# EAGLE design r8.3_1284 (EAGLE 7.4.0)
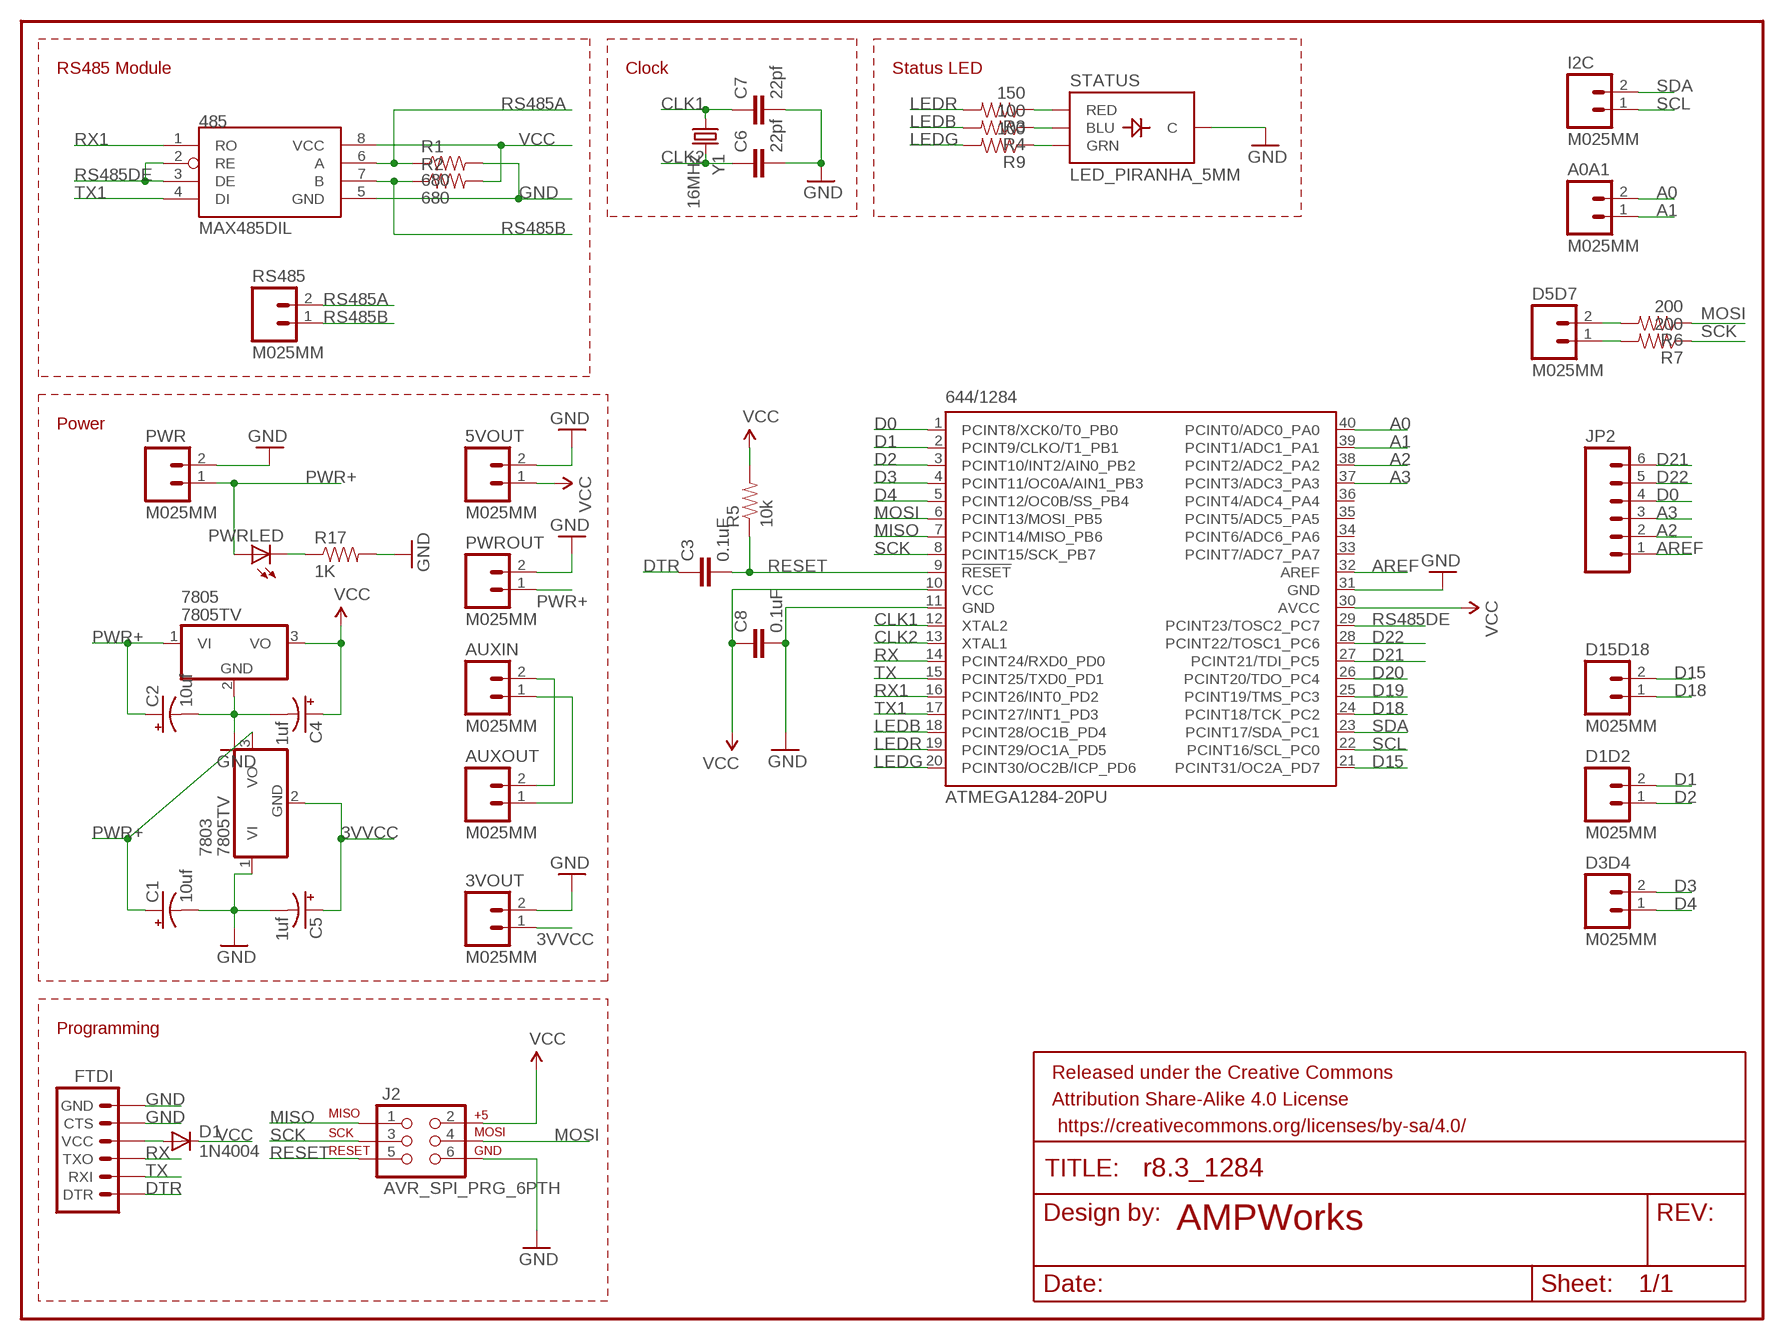
[diagram p0: schematic, sheet 1]

## Parts
3VOUT  M025MM  [SCREWTERMINAL-5MM-2]
5VOUT  M025MM  [SCREWTERMINAL-5MM-2]
485  MAX485DIL  [DIL08]
644/1284  ATMEGA1284-20PU  ATMEGA644-20PU  [DIL40]
7803  7805TV  [TO220V]
7805  7805TV  [TO220V]
A0A1  M025MM  [SCREWTERMINAL-5MM-2]
AUXIN  M025MM  [SCREWTERMINAL-5MM-2]
AUXOUT  M025MM  [SCREWTERMINAL-5MM-2]
C1  10uf  CAP_POLPTH2  [CPOL-RADIAL-10UF-25V]
C2  10uf  CAP_POLPTH2  [CPOL-RADIAL-10UF-25V]
C3  0.1uF  CAPPTH  [CAP-PTH-SMALL]
C4  1uf  CAP_POLPTH2  [CPOL-RADIAL-10UF-25V]
C5  1uf  CAP_POLPTH2  [CPOL-RADIAL-10UF-25V]
C6  22pf  CAPPTH  [CAP-PTH-SMALL]
C7  22pf  CAPPTH  [CAP-PTH-SMALL]
C8  0.1uF  CAPPTH  [CAP-PTH-SMALL]
D1  1N4004  [DO41-10]
D1D2  M025MM  [SCREWTERMINAL-5MM-2]
D3D4  M025MM  [SCREWTERMINAL-5MM-2]
D5D7  M025MM  [SCREWTERMINAL-5MM-2]
D15D18  M025MM  [SCREWTERMINAL-5MM-2]
FRAME1  FRAME-LETTER  [CREATIVE_COMMONS]
FTDI  ARDUINO_SERIAL_PROGRAMPTH  [1X06]
I2C  M025MM  [SCREWTERMINAL-5MM-2]
J2  AVR_SPI_PRG_6PTH  [2X3]
JP2  M06NO_SILK  [1X06_NO_SILK]
PWR  M025MM  [SCREWTERMINAL-5MM-2]
PWRLED  LED5MM  [LED5MM]
PWROUT  M025MM  [SCREWTERMINAL-5MM-2]
R1  680  RESISTORPTH-1/4W  [AXIAL-0.4]
R2  680  RESISTORPTH-1/4W  [AXIAL-0.4]
R3  150  RESISTORPTH-1/4W  [AXIAL-0.4]
R4  100  RESISTORPTH-1/4W  [AXIAL-0.4]
R5  10k  RESISTORPTH-1/4W  [AXIAL-0.4]
R6  200  RESISTORPTH-1/4W  [AXIAL-0.4]
R7  200  RESISTORPTH-1/4W  [AXIAL-0.4]
R9  100  RESISTORPTH-1/4W  [AXIAL-0.4]
R17  1K  RESISTORPTH-1/4W  [AXIAL-0.4]
RS485  M025MM  [SCREWTERMINAL-5MM-2]
STATUS  LED_PIRANHA_5MM  [LED_PIRANHA_5MM]
Y1  16MHz  CRYSTALHC49US  [HC49US]

## Nets
3VVCC: 3VOUT.1 7803.2(GND) C5.1(+)
A0: 644/1284.40(PCINT0/ADC0_PA0) A0A1.2
A1: 644/1284.39(PCINT1/ADC1_PA1) A0A1.1
A2: 644/1284.38(PCINT2/ADC2_PA2) JP2.2
A3: 644/1284.37(PCINT3/ADC3_PA3) JP2.3
AREF: 644/1284.32(AREF) JP2.1
CLK1: 644/1284.12(XTAL2) C7.1 Y1.1
CLK2: 644/1284.13(XTAL1) C6.1 Y1.2
D0: 644/1284.1(PCINT8/XCK0/T0_PB0) JP2.4
D1: 644/1284.2(PCINT9/CLKO/T1_PB1) D1D2.2
D2: 644/1284.3(PCINT10/INT2/AIN0_PB2) D1D2.1
D3: 644/1284.4(PCINT11/OC0A/AIN1_PB3) D3D4.2
D4: 644/1284.5(PCINT12/OC0B/SS_PB4) D3D4.1
D15: 644/1284.21(PCINT31/OC2A_PD7) D15D18.2
D18: 644/1284.24(PCINT18/TCK_PC2) D15D18.1
D19: 644/1284.25(PCINT19/TMS_PC3)
D20: 644/1284.26(PCINT20/TDO_PC4)
D21: 644/1284.27(PCINT21/TDI_PC5) JP2.6
D22: 644/1284.28(PCINT22/TOSC1_PC6) JP2.5
DTR: C3.1 FTDI.DTR
GND: 3VOUT.2 5VOUT.2 485.5(GND) 644/1284.11(GND) 644/1284.31(GND) 7803.1(VI) 7805.2(GND) C1.2(-) C2.2(-) C4.2(-) C5.2(-) C6.2 C7.2 C8.2 FTDI.CTS FTDI.GND J2.6 PWR.2 PWROUT.2 R1.P$2 R17.P$2 STATUS.-(C)
LEDB: 644/1284.18(PCINT28/OC1B_PD4) R4.P$2
LEDG: 644/1284.20(PCINT30/OC2B/ICP_PD6) R9.P$2
LEDR: 644/1284.19(PCINT29/OC1A_PD5) R3.P$2
MISO: 644/1284.7(PCINT14/MISO_PB6) J2.1
MOSI: 644/1284.6(PCINT13/MOSI_PB5) J2.4 R6.P$1
N$1: PWRLED.K(C) R17.P$1
N$2: AUXIN.1 AUXOUT.1
N$3: AUXIN.2 AUXOUT.2
N$4: D5D7.2 R6.P$2
N$5: R3.P$1 STATUS.R(RED)
N$6: R4.P$1 STATUS.B(BLU)
N$7: R9.P$1 STATUS.G(GRN)
N$8: D5D7.1 R7.P$2
N$9: D1.A FTDI.VCC
PWR+: 7803.3(VO) 7805.1(VI) C1.1(+) C2.1(+) PWR.1 PWRLED.A PWROUT.1
RESET: 644/1284.9(!RESET) C3.2 J2.5 R5.P$1
RS485A: 485.6(A) R1.P$1 RS485.2
RS485B: 485.7(B) R2.P$1 RS485.1
RS485DE: 485.2(RE) 485.3(DE) 644/1284.29(PCINT23/TOSC2_PC7)
RX: 644/1284.14(PCINT24/RXD0_PD0) FTDI.TXO
RX1: 485.1(RO) 644/1284.16(PCINT26/INT0_PD2)
SCK: 644/1284.8(PCINT15/SCK_PB7) J2.3 R7.P$1
SCL: 644/1284.22(PCINT16/SCL_PC0) I2C.1
SDA: 644/1284.23(PCINT17/SDA_PC1) I2C.2
TX: 644/1284.15(PCINT25/TXD0_PD1) FTDI.RXI
TX1: 485.4(DI) 644/1284.17(PCINT27/INT1_PD3)
VCC: 5VOUT.1 485.8(VCC) 644/1284.10(VCC) 644/1284.30(AVCC) 7805.3(VO) C4.1(+) C8.1 D1.C J2.2 R2.P$2 R5.P$2
Unconnected: 644/1284.33(PCINT7/ADC7_PA7) 644/1284.34(PCINT6/ADC6_PA6) 644/1284.35(PCINT5/ADC5_PA5) 644/1284.36(PCINT4/ADC4_PA4)

## Notes on the sheet
- RS485 Module | Clock | Status LED
- Power
- Programming
- AMPWorks

## Library data of the parts
3VOUT 5VOUT A0A1 AUXIN AUXOUT D1D2 D3D4 D5D7 D15D18 I2C PWR PWROUT RS485 = SparkFun-Connectors:M02: Standard 2-pin 0.1" header. Use with - straight break away headers ( PRT-00116) - right angle break away headers (PRT-00553) - swiss pins (PRT-00743) - machine pins (PRT-00117) - female headers (PRT-00115) Molex polarized connector foot print use with: PRT-08233 with associated crimp pins and housings. 2.54_SCREWTERM for use with PRT-10571. 3.5mm Screw Terminal footprints for PRT-08084 5mm Screw Terminal footprints for use with PRT-08433
485 = SparkFun-DigitalIC:MAX485: RS-485 transceiver
644/1284 = atmel:ATMEGA644-*PU: 8-bit Microcontroller with 64K Bytes In-System Programmable Flash Auto generated by make-symbol-device-package-bsdl.ulp Rev. 34 Source: http://www.atmel.com/dyn/resources/prod_documents/doc2593.pdf; MPN: ATMEGA644-20PU; OC_FARNELL: 1288340; OC_NEWARK: 23M5060
7803 7805 = linear:78*: Positive VOLTAGE REGULATOR Source: http://cache.national.com/ds/LM/LM78L05.pdf http://www.fairchildsemi.com/ds/LM/LM7805.pdf
C1 C2 C4 C5 = SparkFun-Capacitors:CAP_POL: Capacitor Polarized These are standard SMD and PTH capacitors. Normally 10uF, 47uF, and 100uF in electrolytic and tantalum varieties. Always verify the external diameter of the through hole cap, it varies with capacity, voltage, and manufacturer. The EIA devices should be standard.
C3 C6-C8 = SparkFun-Capacitors:CAP: Capacitor Standard 0603 ceramic capacitor, and 0.1" leaded capacitor.
D1 = adafruit:1N4004: DIODE General purpose 1N400x type rectifier (With bigger pads) http://www.ladyada.net/library/pcb/eaglelibrary.html
FRAME1 = SparkFun-Aesthetics:FRAME-LETTER: Schematic Frame Standard 8.5x11 US Letter frame
FTDI = SparkFun-Connectors:ARDUINO_SERIAL_PROGRAM: FTDI connector footprints
J2 = SparkFun-Connectors:AVR_SPI_PRG_6: AVR ISP 6 Pin This is the reduced ISP connector for AVR programming. Common on Arduino. This footprint will take up less PCB space and can be used with a 10-pin to 6-pin adapter such as SKU: BOB-08508
JP2 = SparkFun-Connectors:M06: Header 6 Standard 6-pin 0.1" header. Use with straight break away headers (SKU : PRT-00116), right angle break away headers (PRT-00553), swiss pins (PRT-00743), machine pins (PRT-00117), and female headers (PRT-00115). Molex polarized connector foot print use with SKU : PRT-08094 with associated crimp pins and housings. NOTES ON THE VARIANTS LOCK and LOCK_LONGPADS... This footprint was designed to help hold the alignment of a through-hole component (i.e. 6-pin header) while soldering it into place. You may notice that each hole has been shifted either up or down by 0.005 of an inch from it's more standard position (which is a perfectly straight line). This slight alteration caused the pins (the squares in the middle) to touch the edges of the holes. Because they are alternating, it causes a "brace" to hold the component in place. 0.005 has proven to be the perfect amount of "off-center" position when using our standard breakaway headers. Although looks a little odd when you look at the bare footprint, once you have a header in there, the alteration is very hard to notice. Also,if you push a header all the way into place, it is covered up entirely on the bottom side. This idea of altering the position of holes to aid alignment will be further integrated into the Sparkfun Library for other footprints. It can help hold any component with 3 or more connection pins.
PWRLED = SparkFun-LED:LED: LEDs Standard schematic elements and footprints for 5mm, 3mm, 1206, and 0603 sized LEDs. 5mm - Spark Fun Electronics SKU : COM-00529 (and others)
R1 R2 R17 = SparkFun-Resistors:RESISTOR: Resistor Basic schematic elements and footprints for 0603, 1206, and PTH resistors.
R3-R7 R9 = SparkFun-Passives:RESISTOR: Resistor Basic schematic elements and footprints for 0603, 1206, and PTH resistors.
STATUS = SparkFun-LED:LED_PIRANHA_5MM: High-brightness RGB through-hole LED, similar to that used in the Shiftbrite
Y1 = SparkFun-FreqCtrl:CRYSTAL: Various standard crystals. Proven footprints. Spark Fun Electronics SKU : COM-00534

## Board
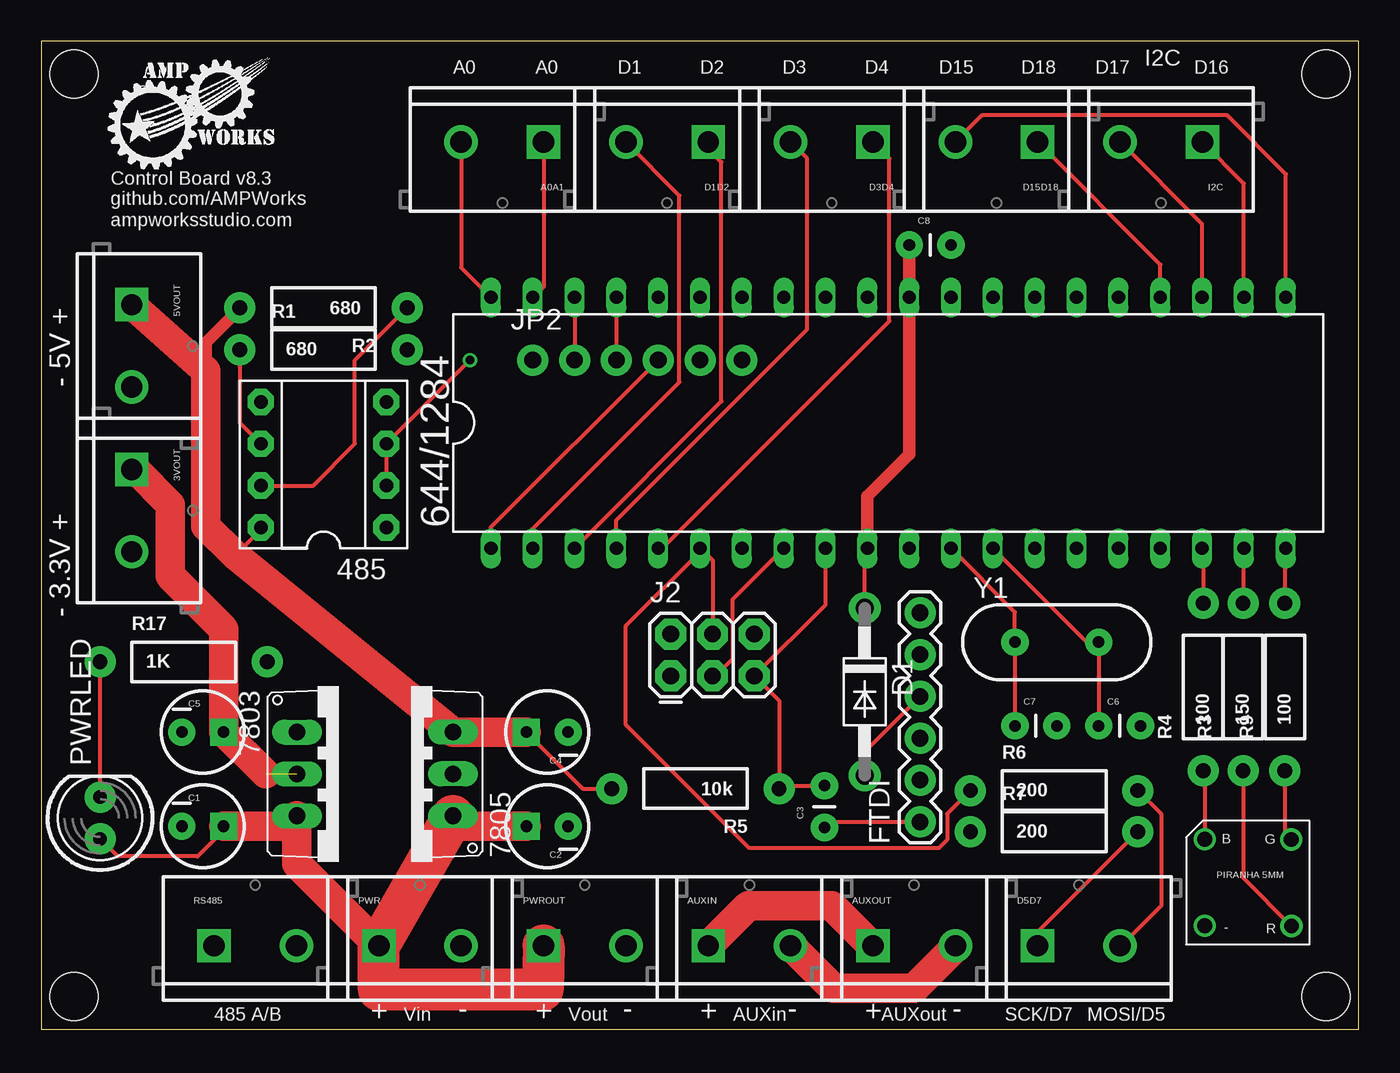
[diagram p1: board, top side]
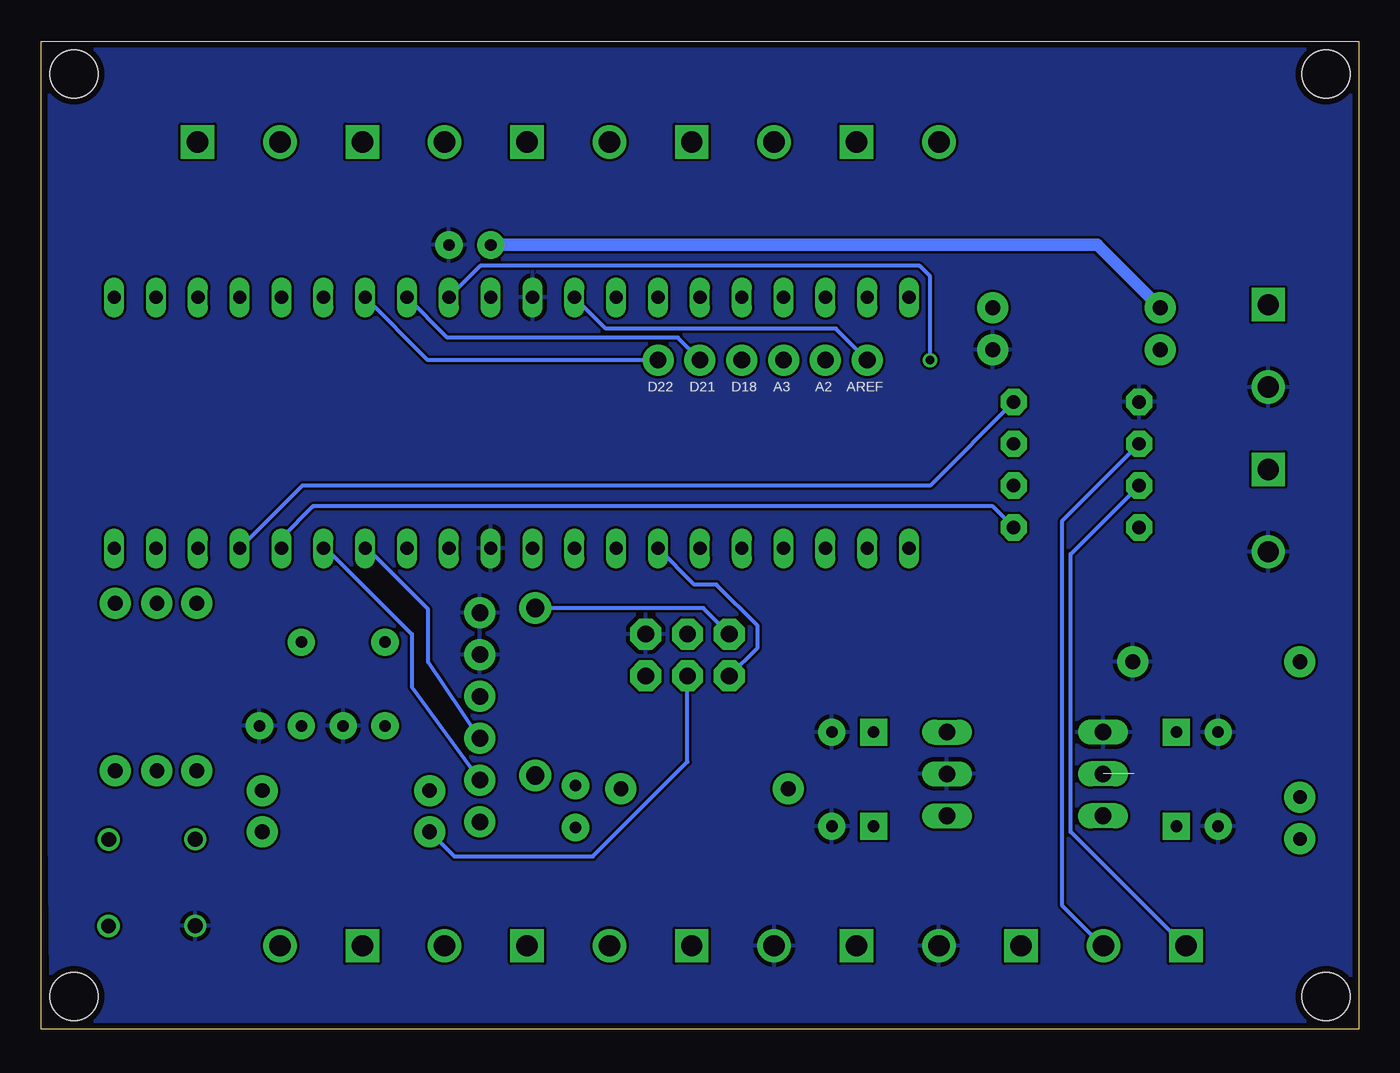
[diagram p2: board, bottom side, seen from below]

Size 80 x 60 mm. Coordinates in mm from the lower left corner, seen from the top.
Outline: 0,0 80,0 80,60 0,60 0,0
Copper layers (1*16): Top 0.0356mm / dielectric 1.5011mm / Bottom 0.0356mm
Design rules "OSHParkDesignRules": minimum track width 6mil, minimum drill 13mil, track to track 6mil, track to pad 6mil, pad to pad 6mil, via to via 6mil, smd to smd 6mil, copper to edge 15mil, drill to drill 6mil, minimum pad ring 7mil, minimum via ring 7mil, stop-mask expansion 3mil, vias tented up to drill 0mil, thermal gap 10mil
Holes 2.92 mm at 2,58 78,58 78,2 2,2

### Footprints (pad centres in the part's own frame; a part is rotated, then mirrored left to right if it is on the bottom)
SCREWTERMINAL-5MM-2 = drill 1.3 pad 2.032 square: 1 0,0 | drill 1.3 pad 2.032: 2 5,0
DIL08 = drill 0.813 pad 1.6 octagon: 1 -3.81,-3.81; 2 -1.27,-3.81; 3 1.27,-3.81; 4 3.81,-3.81; 5 3.81,3.81; 6 1.27,3.81; 7 -1.27,3.81; 8 -3.81,3.81
DIL40 = drill 0.813 long: 1 -24.13,-7.62; 2 -21.59,-7.62; 3 -19.05,-7.62; 4 -16.51,-7.62; 5 -13.97,-7.62; 6 -11.43,-7.62; 7 -8.89,-7.62; 8 -6.35,-7.62; 9 -3.81,-7.62; 10 -1.27,-7.62; 11 1.27,-7.62; 12 3.81,-7.62; 13 6.35,-7.62; 14 8.89,-7.62; 15 11.43,-7.62; 16 13.97,-7.62; 17 16.51,-7.62; 18 19.05,-7.62; 19 21.59,-7.62; 20 24.13,-7.62; 21 24.13,7.62; 22 21.59,7.62; 23 19.05,7.62; 24 16.51,7.62; 25 13.97,7.62; 26 11.43,7.62; 27 8.89,7.62; 28 6.35,7.62; 29 3.81,7.62; 30 1.27,7.62; 31 -1.27,7.62; 32 -3.81,7.62; 33 -6.35,7.62; 34 -8.89,7.62; 35 -11.43,7.62; 36 -13.97,7.62; 37 -16.51,7.62; 38 -19.05,7.62; 39 -21.59,7.62; 40 -24.13,7.62
TO220V = drill 1.016 long: 1 -2.54,-2.54; 2 0,-2.54; 3 2.54,-2.54
CPOL-RADIAL-10UF-25V = drill 0.7 pad 1.651 square: 1 1.27,0 | drill 0.7 pad 1.651: 2 -1.27,0
CAP-PTH-SMALL = drill 0.7 pad 1.651: 1 0,0; 2 2.54,0
DO41-10 = drill 1.118 pad 1.93: A 5.08,0; C -5.08,0
1X06 = drill 1.016 pad 1.88: CTS 10.16,0; DTR 0,0; GND 12.7,0; RXI 2.54,0; TXO 5.08,0; VCC 7.62,0
2X3 = drill 1.016 pad 1.88 octagon: 1 0,0; 2 0,2.54; 3 2.54,0; 4 2.54,2.54; 5 5.08,0; 6 5.08,2.54
1X06_NO_SILK = drill 1.016 pad 1.88: 1 0,0; 2 2.54,0; 3 5.08,0; 4 7.62,0; 5 10.16,0; 6 12.7,0
LED5MM = drill 0.813 pad 1.88: A -1.27,0; K 1.27,0
AXIAL-0.4 = drill 0.9 pad 1.88: P$1 -5.08,0; P$2 5.08,0
LED_PIRANHA_5MM = drill 0.9: - -2.684,-2.684; B -2.688,2.574; G 2.575,2.562; R 2.579,-2.696
HC49US = drill 0.7 pad 1.651: 1 -2.54,0; 2 2.54,0

### Placement (x,y rotation side)
3VOUT  5.5,34 270 top
5VOUT  5.5,44 270 top
485  17.14,34.29 90 top
644/1284  51.44,36.83 0 top
7803  18.07,15.51 270 top
7805  22.47,15.51 90 top
A0A1  30.5,53.88 180 top
AUXIN  40.5,5.08 0 top
AUXOUT  50.5,5.08 0 top
C1  9.81,12.34 0 top
C2  30.73,12.34 180 top
C3  47.55,12.26 90 top
C4  30.73,18.05 180 top
C5  9.81,18.05 0 top
C6  64.2,18.43 0 top
C7  59.12,18.43 0 top
C8  52.7,47.62 0 top
D1  50,20.5 270 top
D1D2  40.5,53.88 180 top
D3D4  50.5,53.88 180 top
D5D7  60.5,5.08 0 top
D15D18  60.5,53.88 180 top
FRAME1  21.59,-8.89 0 top  (outside the outline)
FTDI  53.36,12.6 90 top
I2C  70.5,53.88 180 top
J2  38.22,21.46 0 top
JP2  29.84,40.64 0 top
PWR  20.5,5.08 0 top
PWRLED  3.58,12.84 90 top
PWROUT  30.5,5.08 0 top
R1  17.14,41.27 0 top
R2  17.14,43.81 180 top
R3  72.97,20.79 90 top
R4  70.55,20.79 90 top
R5  39.72,14.62 180 top
R6  61.5,14.5 0 top
R7  61.5,12 0 top
R9  75.51,20.79 90 top
R17  8.65,22.32 0 top
RS485  10.5,5.08 0 top
STATUS  73.33,8.97 0 top
Y1  61.66,23.51 0 top

### Tracks (layer width: path | path; a pad name or v marks a point on that pad's centre or on a via)
3VVCC  (1 unrouted)
  Top 1.778: 13.62,15.51 C5.1 11.1,18.07 11.1,24.3 7.85,27.55 7.85,31.85 5.7,34 3VOUT.1
A0
  Top 0.254: A0A1.2 25.5,46.26 644/1284.40
A1
  Top 0.254: A0A1.1 30.5,45.1 644/1284.39
A2
  Top 0.254: 644/1284.38 JP2.2
A3
  Top 0.254: 644/1284.37 JP2.3
AREF
  Bottom 0.254: JP2.1 31.75,42.55 45.72,42.55 644/1284.32
CLK1
  Top 0.254: C7.1 Y1.1 59.12,25.33 644/1284.12
CLK2
  Top 0.254: C6.1 Y1.2 63.48,23.51 644/1284.13
D0
  Top 0.254: 644/1284.1 27.3,30.48 JP2.4
D1
  Top 0.254: 644/1284.2 29.84,30.39 38.75,39.3 38.75,50.63 D1D2.2
D2
  Top 0.254: 644/1284.3 41.3,38.12 41.3,52.65 40.5,53.45 D1D2.1
D3
  Top 0.254: 644/1284.4 34.92,30.93 46.5,42.5 46.5,52.88 D3D4.2
D4
  Top 0.254: 644/1284.5 37.71,29.21 51.5,43 51.5,52.88 D3D4.1
D15
  Top 0.254: 644/1284.21 75.56,51.94 72,55.5 57.12,55.5 D15D18.2
D18
  Top 0.254: 644/1284.24 67.94,46.44 D15D18.1
D21
  Bottom 0.254: JP2.6 56.52,40.64 644/1284.27
D22
  Bottom 0.254: JP2.5 40.01,40.66 41.35,42 55.34,42 644/1284.28
DTR
  Top 0.254: C3.1 47.89,12.6 FTDI.DTR
GND
  pour Bottom: 0,60 80,60 79.38,0 0,0
LEDB
  Top 0.254: 644/1284.18 70.55,29.14 R4.P$2
LEDG
  Top 0.254: 644/1284.20 75.51,29.16 R9.P$2
LEDR
  Top 0.254: 644/1284.19 72.97,29.16 R3.P$2
MISO
  Bottom 0.254: J2.1 36.5,23.18 36.5,24.5 39,27 40.34,27 644/1284.7
MOSI
  Top 0.254: R6.P$1 55,13.08 55,11.5 54.5,11 43,11 35.5,18.5 35.5,24.5 40.01,29 644/1284.6 40.05,29.21 40.76,28.5 J2.4
N$1
  Top 0.254: PWRLED.K R17.P$1
N$2
  Top 1.778: AUXIN.1 42.92,7.5 48,7.5 50.42,5.08 AUXOUT.1
N$3
  Top 1.778: AUXIN.2 48.08,2.5 53,2.5 55.5,5 AUXOUT.2
N$4
  Top 0.254: R6.P$2 68,13.08 68,7.5 65.58,5.08 D5D7.2
N$5
  Top 0.254: R3.P$1 72.97,9.21 STATUS.R
N$6
  Top 0.254: R4.P$1 70.64,15.61 STATUS.B
N$7
  Top 0.254: R9.P$1 75.51,11.93 STATUS.G
N$8
  Top 0.254: R7.P$2 60.5,5.92 D5D7.1
N$9
  Top 0.254: D1.A 50,16.86 FTDI.VCC
PWR+
  Top 0.254: C1.1 11.08,12.08 9.5,10.5 4.64,10.5 PWRLED.A
  Top 1.778: C2.1 25.64,12.34 7805.1 | C1.1 14.89,12.34 7803.3 15.53,10.06 PWR.1
  Top 2.54: PWROUT.1 30.44,2.4 20.51,2.4 PWR.1 7805.1
RESET
  Top 0.254: C3.2 44.98,14.8 R5.P$1 44.8,19.96 J2.5 47.62,25.79 644/1284.9
RS485A
  Top 0.254: R1.P$1 12.06,36.83 485.6
  Bottom 0.254: RS485.2 15.58,5.08 18,7.5 18,30.89 485.6
RS485B
  Top 0.254: 485.7 16.51,33.02 19.05,35.56 19.05,40.64 R2.P$1
  Bottom 0.254: RS485.1 10.58,5.08 17.5,12 17.5,28.86 485.7
RS485DE  (via drill 0.5)
  Top 0.254: v26.04,40.64 485.3 485.2
  Bottom 0.254: v26.04,40.64 26.04,45.72 26.67,46.35 53.34,46.35 644/1284.29
RX
  Bottom 0.254: FTDI.TXO 56.5,22.32 56.5,25.5 60.21,29.21 644/1284.14
RX1
  Bottom 0.254: 485.1 22.23,31.75 63.5,31.75 65.41,29.84 644/1284.16
SCK
  Top 0.254: J2.3 40.96,21.46 42,22.5 42,26.12 644/1284.8
  Bottom 0.254: R7.P$1 54.92,10.5 46.5,10.5 40.76,16.24 J2.3
SCL
  Top 0.254: 644/1284.22 73.03,51.35 I2C.1
SDA
  Top 0.254: 644/1284.23 70.48,48.9 I2C.2
TX
  Bottom 0.254: 644/1284.15 62.71,29.21 57.5,24 57.5,20.77 FTDI.RXI
TX1
  Bottom 0.254: 485.4 26.04,33.02 64.14,33.02 644/1284.17
VCC
  Top 0.254: 485.8 13.34,30.34 11.78,28.78 | R2.P$2 12.06,43.77 | C4.1 32.88,14.62 R5.P$2 | D1.C 50,29.05 644/1284.10
  Top 0.762: C8.1 644/1284.30 52.7,34.92 50.16,32.38 644/1284.10 | 12.06,43.77 10,41.7 10,39.5
  Top 1.778: C4.1 7805.3 11.78,28.78 10,30.56 10,39.5 10,40 5VOUT.1
  Bottom 0.254: J2.2 39.8,25.58 D1.C
  Bottom 0.762: R2.P$2 15.88,47.62 C8.1

### Text on the board
tPlace: A0 | A0 | D1 | D2 | D3 | D4 | D15 | D18 | D17 | I2C | D16 | Control Board v8.3 | github.com/AMPWorks | ampworksstudio.com | - 5V + | - 3.3V + | - | - | - | - | 485 A/B | + | Vin | + | Vout | + | AUXin | + | AUXout | SCK/D7 | MOSI/D5
bPlace: AREF | A2 | A3 | D18 | D21 | D22